# EAGLE design WH-MDC05F3E5_comm_v2.0 (EAGLE 6.6.0)
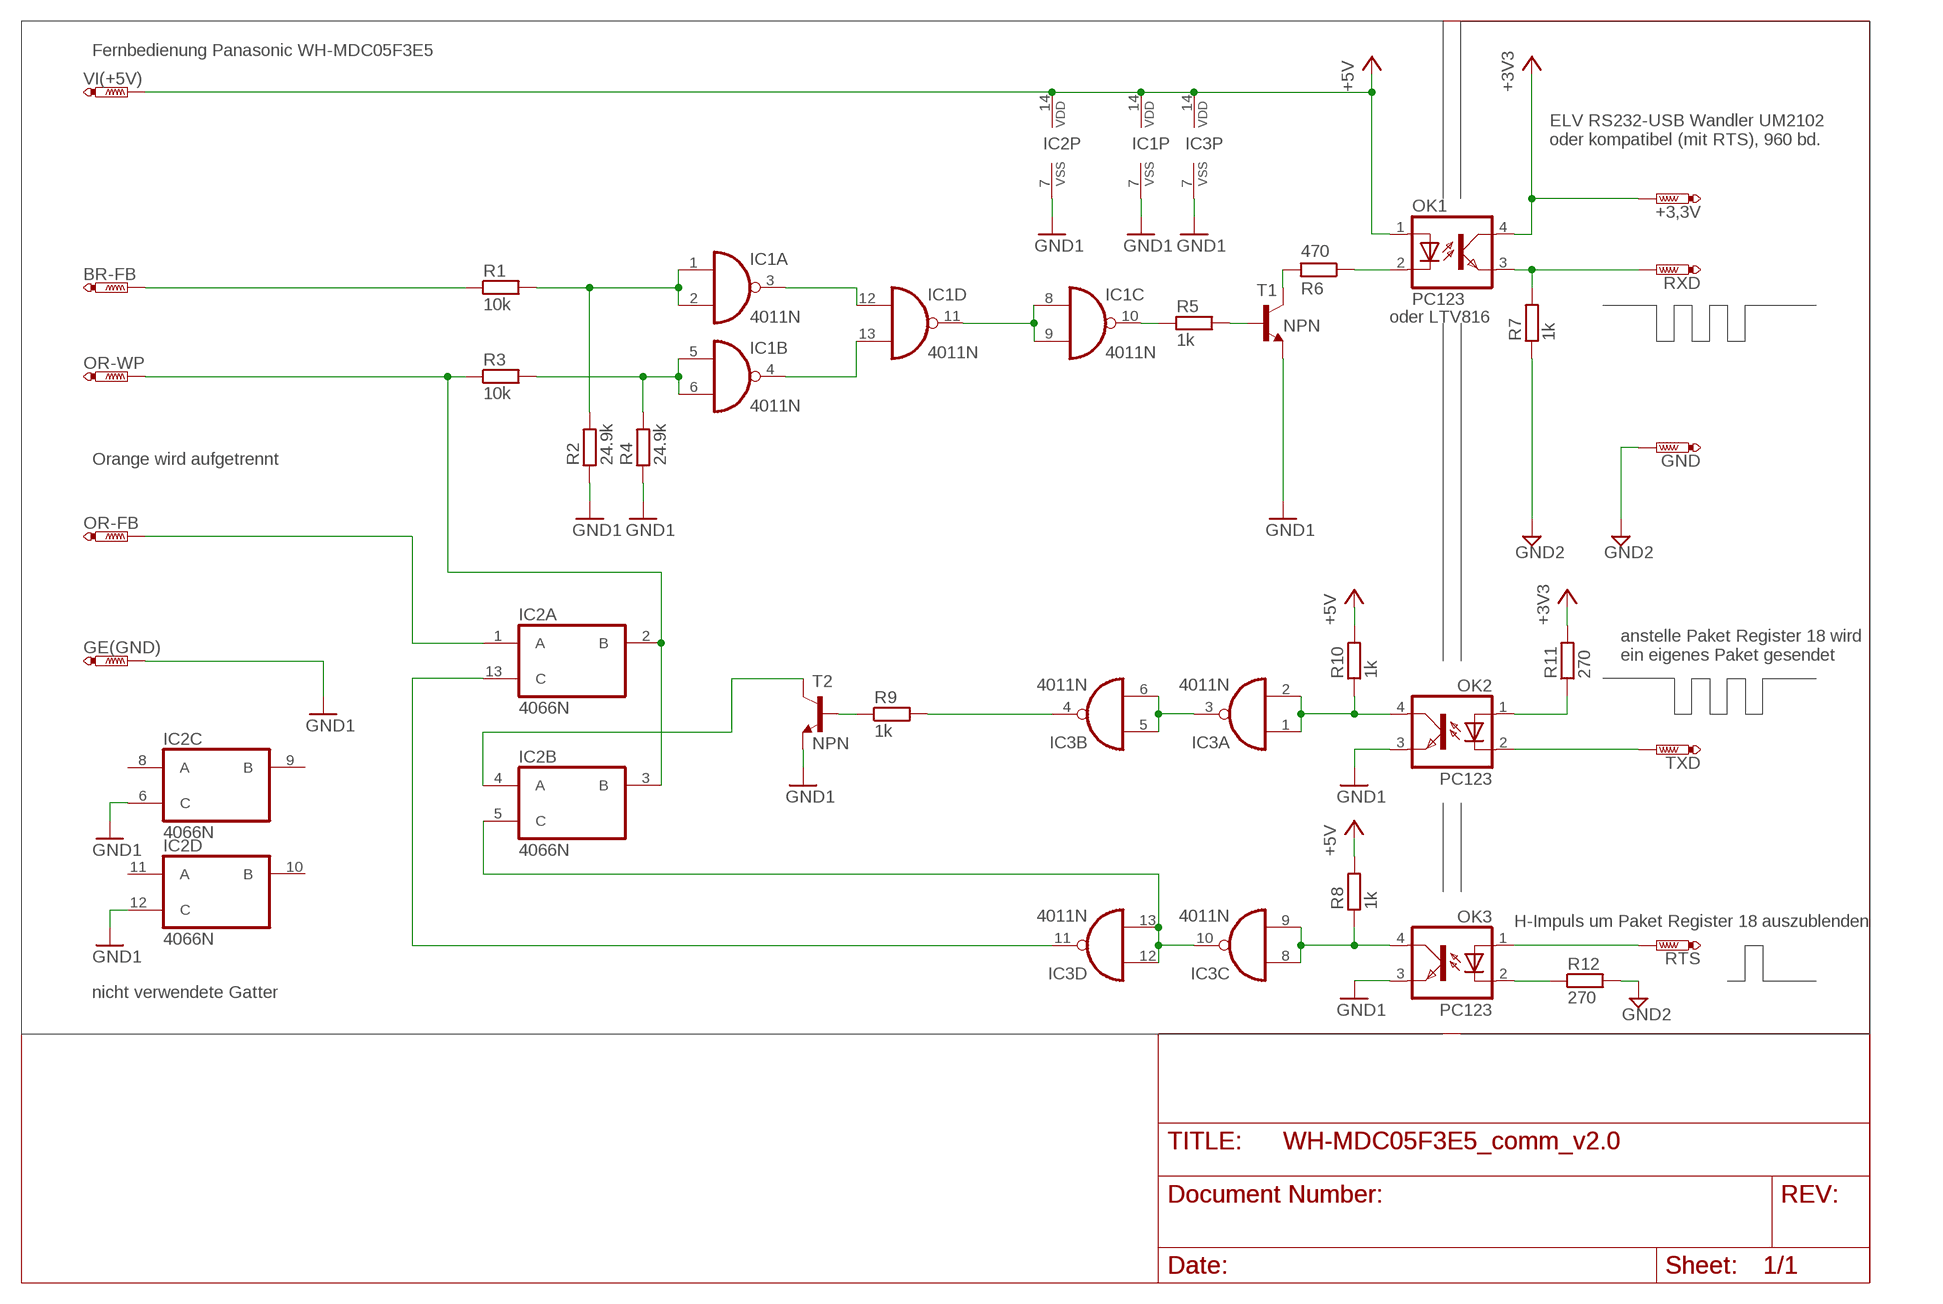
[diagram p0: schematic, sheet 1]

## Parts
+3,3V  PTR1PAD1-17  [P1-17]
BR-FB  PTR1PAD1-17  [P1-17]
GE(GND)  PTR1PAD1-17  [P1-17]
GND  PTR1PAD1-17  [P1-17]
IC1  4011N  [DIL14]
IC2  4066N  [DIL14]
IC3  4011N  [DIL14]
OK1  PC123  PC817  [DIL04]
OK2  PC123  PC817  [DIL04]
OK3  PC123  PC817  [DIL04]
OR-FB  PTR1PAD1-17  [P1-17]
OR-WP  PTR1PAD1-17  [P1-17]
R1  10k  R-EU_0207/10  [0207/10]
R2  24.9k  R-EU_0207/10  [0207/10]
R3  10k  R-EU_0207/10  [0207/10]
R4  24.9k  R-EU_0207/10  [0207/10]
R5  1k  R-EU_0207/10  [0207/10]
R6  470  R-EU_0207/10  [0207/10]
R7  1k  R-EU_0207/10  [0207/10]
R8  1k  R-EU_0207/7  [0207/7]
R9  1k  R-EU_0207/10  [0207/10]
R10  1k  R-EU_0207/7  [0207/7]
R11  270  R-EU_0207/7  [0207/7]
R12  270  R-EU_0207/7  [0207/7]
RTS  PTR1PAD1-17  [P1-17]
RXD  PTR1PAD1-17  [P1-17]
T1  NPN  BC547-NPN-TO92-CBE  [TO92-CBE]
T2  NPN  BC547-NPN-TO92-CBE  [TO92-CBE]
TXD  PTR1PAD1-17  [P1-17]
VI(+5V)  PTR1PAD1-17  [P1-17]

## Nets
+3V3: +3,3V.TP OK1.4(COL) R11.2
+5V: IC1.14(P:VDD) IC2.14(P:VDD) IC3.14(P:VDD) OK1.1(A) R8.2 R10.2 VI(+5V).TP
GND1: GE(GND).TP IC1.7(P:VSS) IC2.6(C:C) IC2.7(P:VSS) IC2.12(D:C) IC3.7(P:VSS) OK2.3(EMIT) OK3.3(EMIT) R2.1 R4.1 T1.E T2.E
GND2: GND.TP R7.1 R12.2
N$1: IC1.1(A:I0) IC1.2(A:I1) R1.2 R2.2
N$2: IC1.5(B:I0) IC1.6(B:I1) R3.2 R4.2
N$3: IC1.3(A:O) IC1.12(D:I0)
N$4: IC1.4(B:O) IC1.13(D:I1)
N$5: IC1.8(C:I0) IC1.9(C:I1) IC1.11(D:O)
N$6: IC1.10(C:O) R5.1
N$7: R5.2 T1.B
N$8: R6.2 T1.C
N$9: OK1.2(C) R6.1
N$10: OK1.3(EMIT) R7.2 RXD.TP
N$11: IC2.4(B:A) T2.C
N$12: OK2.1(A) R11.1
N$13: IC2.1(A:A) OR-FB.TP
N$14: IC2.2(A:B) IC2.3(B:B) OR-WP.TP R3.1
N$15: BR-FB.TP R1.1
N$16: OK2.2(C) TXD.TP
N$17: IC2.13(A:C) IC3.11(D:O)
N$18: IC3.8(C:I0) IC3.9(C:I1) OK3.4(COL) R8.1
N$19: IC2.5(B:C) IC3.10(C:O) IC3.12(D:I0) IC3.13(D:I1)
N$20: OK3.2(C) R12.1
N$21: OK3.1(A) RTS.TP
N$23: IC3.1(A:I0) IC3.2(A:I1) OK2.4(COL) R10.1
N$25: IC3.3(A:O) IC3.5(B:I0) IC3.6(B:I1)
N$26: R9.1 T2.B
N$27: IC3.4(B:O) R9.2
Unconnected: IC2.8(C:A) IC2.9(C:B) IC2.10(D:B) IC2.11(D:A)

## Notes on the sheet
- Fernbedienung Panasonic WH-MDC05F3E5
- ELV RS232-USB Wandler UM2102
  oder kompatibel (mit RTS), 960 bd.
- oder LTV816
- Orange wird aufgetrennt
- anstelle Paket Register 18 wird
  ein eigenes Paket gesendet
- H-Impuls um Paket Register 18 auszublenden
- nicht verwendete Gatter

## Library data of the parts
+3,3V BR-FB GE(GND) GND OR-FB OR-WP RTS RXD TXD VI(+5V) = testpad:PTR1: TEST PIN
IC1 IC3 = 40xx:4011: Quad 2-input NAND
IC2 = 40xx:4066: Quad bilateral ANALOG SWITCH
OK1-OK3 = optocoupler:PC817: SHARP OPTO COUPLER; MPN: PC817X4J000F; OC_FARNELL: 9707727; OC_NEWARK: 97K7059
R1-R12 = resistor:R-EU_: RESISTOR, European symbol
T1 T2 = transistor:*-NPN-: NPN Transistror BF959 corrected 2008.03.06

## Board
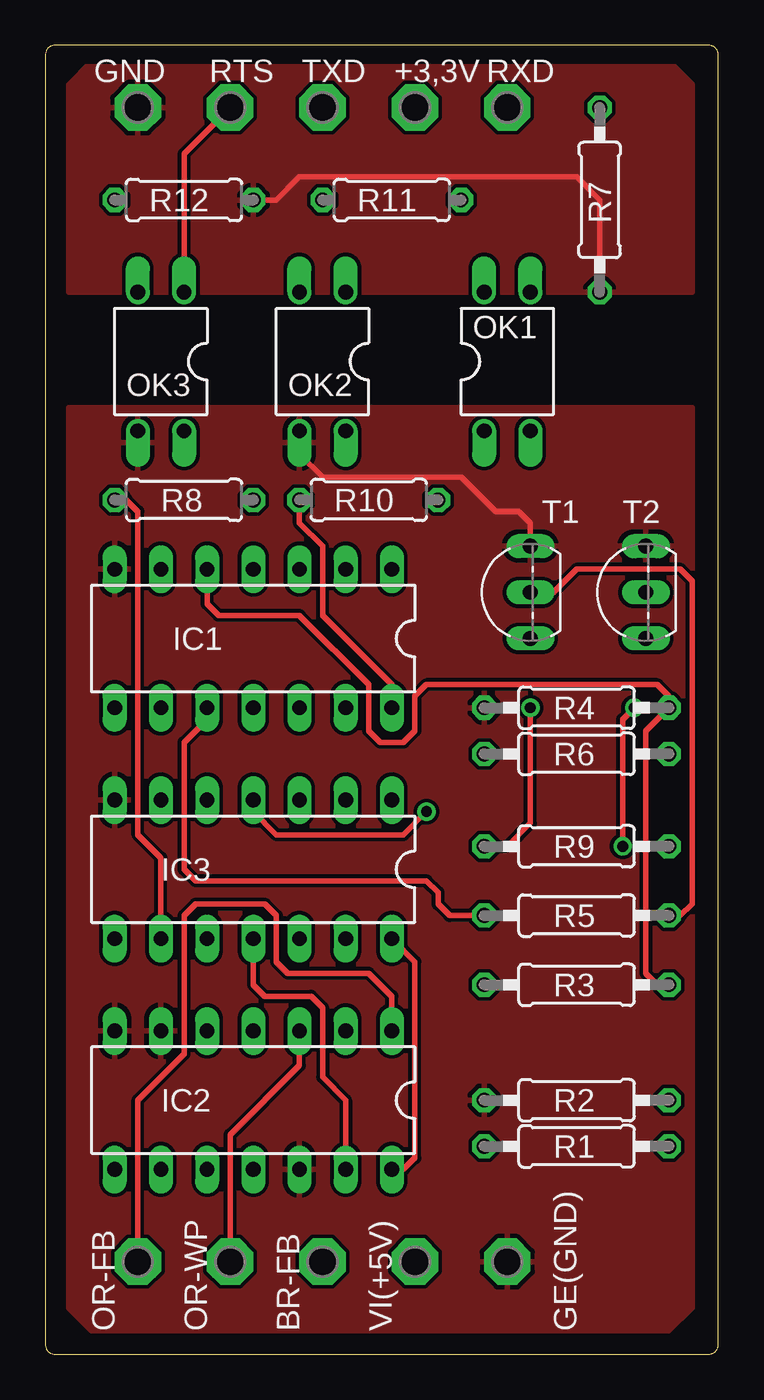
[diagram p1: board, top side]
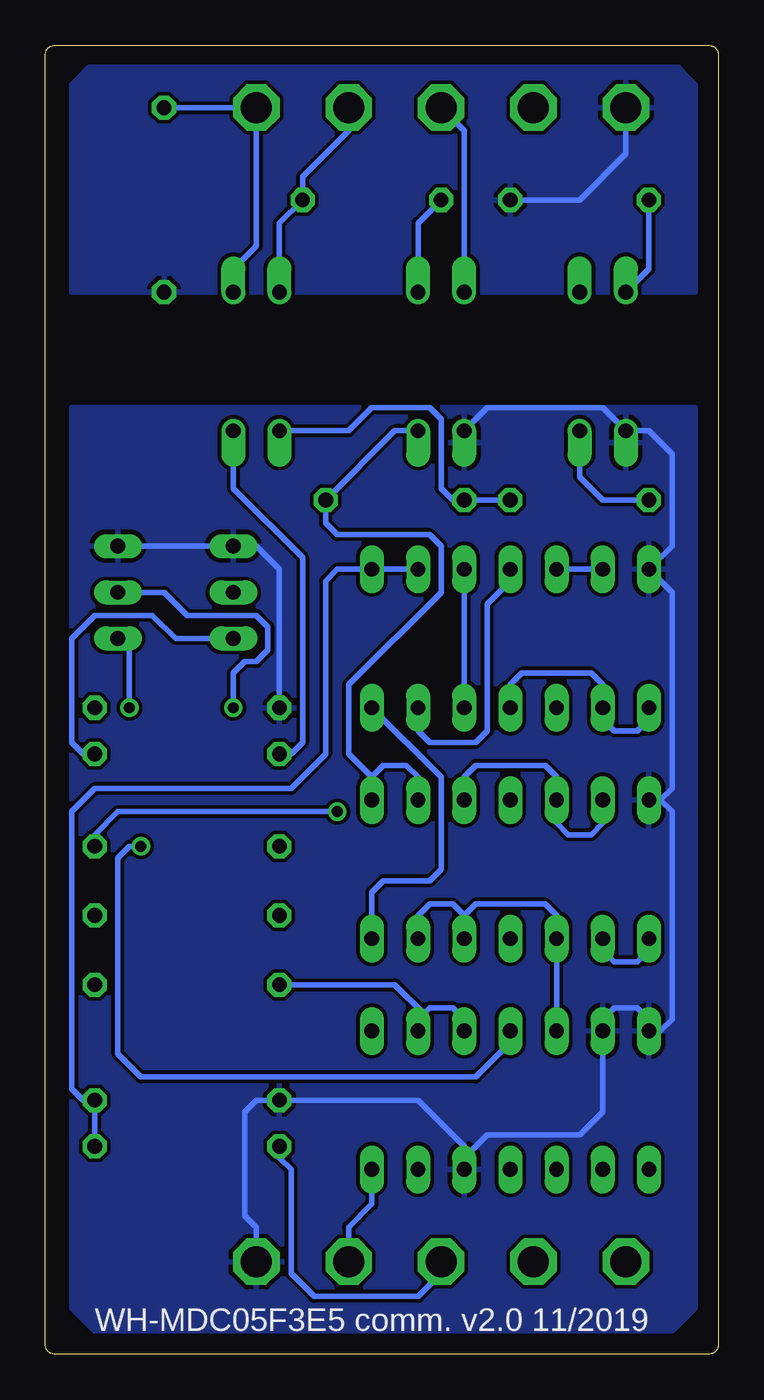
[diagram p2: board, bottom side, seen from below]

Size 37 x 72 mm. Coordinates in mm from the lower left corner, seen from the top.
Outline: 0,71.5 0,0.5 arc90 0.5,0 36.5,0 arc90 37,0.5 37,71.5 arc90 36.5,72 0.5,72 arc90 0,71.5
Copper layers (1*16): Top 0.035mm / dielectric 1.5mm / Bottom 0.035mm
Design rules "default": minimum track width 10mil, minimum drill 24mil, track to track 8mil, track to pad 8mil, pad to pad 8mil, via to via 8mil, smd to smd 8mil, copper to edge 40mil, drill to drill 8mil, minimum pad ring 10mil, minimum via ring 8mil, stop-mask expansion 4mil, vias tented up to drill 0mil, thermal gap 10mil

### Footprints (pad centres in the part's own frame; a part is rotated, then mirrored left to right if it is on the bottom)
P1-17 = drill 1.702 pad 2.54 octagon: TP 0,0
DIL14 = drill 0.813 long: 1 -7.62,-3.81; 2 -5.08,-3.81; 3 -2.54,-3.81; 4 0,-3.81; 5 2.54,-3.81; 6 5.08,-3.81; 7 7.62,-3.81; 8 7.62,3.81; 9 5.08,3.81; 10 2.54,3.81; 11 0,3.81; 12 -2.54,3.81; 13 -5.08,3.81; 14 -7.62,3.81
DIL04 = drill 0.813 offset: 1 -1.27,-3.81; 2 1.27,-3.81; 3 1.27,3.81; 4 -1.27,3.81
0207/10 = drill 0.813 octagon: 1 -5.08,0; 2 5.08,0
0207/7 = drill 0.813 octagon: 1 -3.81,0; 2 3.81,0
TO92-CBE = drill 0.813 long: B 0,0; C -2.54,0; E 2.54,0

### Placement (x,y rotation side)
+3,3V  20.32,68.58 0 top
BR-FB  15.24,5.08 0 top
GE(GND)  25.4,5.08 0 top
GND  5.08,68.58 0 top
IC1  11.43,39.37 180 top
IC2  11.43,13.97 180 top
IC3  11.43,26.67 180 top
OK1  25.4,54.61 0 top
OK2  15.24,54.61 180 top
OK3  6.35,54.61 180 top
OR-FB  5.08,5.08 0 top
OR-WP  10.16,5.08 0 top
R1  29.21,11.43 0 top
R2  29.21,13.97 0 top
R3  29.21,20.32 0 top
R4  29.21,35.56 0 top
R5  29.21,24.13 0 top
R6  29.21,33.02 0 top
R7  30.48,63.5 90 top
R8  7.62,46.99 0 top
R9  29.21,27.94 0 top
R10  17.78,46.99 180 top
R11  19.05,63.5 0 top
R12  7.62,63.5 0 top
RTS  10.16,68.58 0 top
RXD  25.4,68.58 0 top
T1  26.67,41.91 90 top
T2  33.02,41.91 90 top
TXD  15.24,68.58 0 top
VI(+5V)  20.32,5.08 0 top

### Tracks (layer width: path | path; a pad name or v marks a point on that pad's centre or on a via)
+3V3
  Bottom 0.305: OK1.4 24.13,62.23 R11.2 22.86,64.77 20.32,67.31 +3,3V.TP
+5V
  Top 0.305: IC1.14 19.05,36.83 15.24,40.64 15.24,44.45 13.97,45.72 R10.2 | IC2.14 19.68,10.16 20.32,10.79 20.32,21.59 IC3.14
  Bottom 0.305: R8.2 R10.2 14.61,46.99 15.24,47.62 15.24,51.44 15.88,52.07 19.05,52.07 20.32,50.8 OK1.1 | IC2.14 19.05,8.26 20.32,6.99 VI(+5V).TP | IC1.14 15.24,31.75 15.24,26.67 15.88,26.04 18.41,26.04 19.05,25.4 IC3.14
GND1
  Top 0.305: OK2.3 13.97,49.53 15.24,48.26 22.86,48.26 24.77,46.35 26.04,46.35 26.67,45.72 T1.E
  Bottom 0.305: OK2.3 12.7,52.07 6.35,52.07 OK3.3 3.81,50.8 2.54,49.53 2.54,44.45 IC1.7 2.54,41.91 2.54,31.11 3.17,30.48 | T2.E T1.E 25.4,44.45 24.13,43.18 R4.1 | 3.17,30.48 IC3.7 | 3.17,30.48 2.54,29.84 2.54,18.41 3.17,17.78 IC2.7 3.81,18.41 4.45,19.05 5.71,19.05 6.35,18.41 IC2.6 6.35,13.34 7.62,12.06 12.7,12.06 13.97,10.79 IC2.12 13.97,11.43 16.51,13.97 R2.1 25.4,13.97 26.04,13.34 26.04,7.62 25.4,6.99 GE(GND).TP
  pour Bottom: 1.27,2.54 2.54,1.27 34.29,1.27 35.56,2.54 35.56,52.07 1.27,52.07
  pour Top: 1.27,52.07 35.56,52.07 35.56,2.54 34.29,1.27 2.54,1.27 1.27,2.54
GND2
  Top 0.305: R12.2 12.7,63.5 13.97,64.77 29.21,64.77 30.48,63.5 R7.1
  Bottom 0.305: GND.TP 5.08,66.04 7.62,63.5 R12.2
  pour Top: 1.27,69.85 2.54,71.12 34.29,71.12 35.56,69.85 35.56,58.42 1.27,58.42
  pour Bottom: 1.27,58.42 1.27,69.85 2.54,71.12 34.29,71.12 35.56,69.85 35.56,58.42
N$1
  Bottom 0.305: IC1.2 IC1.1 20.95,43.18 21.59,42.55 21.59,33.02 23.5,31.11 34.29,31.11 35.56,29.84 35.56,14.61 34.92,13.97 R2.2 R1.2
N$2
  Top 0.305: IC1.5 8.89,41.27 9.53,40.64 13.97,40.64 17.78,36.83 17.78,34.29 18.41,33.66 19.68,33.66 20.32,34.29 20.32,36.2 20.95,36.83 33.66,36.83 34.29,36.2 R4.2 33.02,34.29 33.02,20.95 33.66,20.32 R3.2
  Bottom 0.305: IC1.6 IC1.5
N$3
  Bottom 0.305: IC1.12 IC1.3
N$4
  Bottom 0.305: IC1.13 16.51,34.29 15.88,33.66 13.34,33.66 12.7,34.29 12.7,41.27 11.43,42.55 IC1.4
N$5
  Bottom 0.305: IC1.8 3.81,34.92 4.45,34.29 5.71,34.29 6.35,34.92 IC1.9 6.35,36.83 6.99,37.47 10.79,37.47 11.43,36.83 IC1.11
N$6
  Top 0.305: R5.1 22.23,24.13 21.59,24.77 21.59,25.4 20.95,26.04 8.26,26.04 7.62,26.67 7.62,33.66 8.89,34.92 IC1.10
N$7
  Top 0.305: R5.2 34.92,24.13 35.56,24.77 35.56,42.55 34.92,43.18 29.21,43.18 27.94,41.91 T1.B
N$8
  Bottom 0.305: T1.C 29.84,39.37 31.11,40.64 34.29,40.64 35.56,39.37 35.56,33.66 34.92,33.02 R6.2
N$9
  Bottom 0.305: OK1.2 26.67,47.62 22.86,43.81 22.86,33.66 23.5,33.02 R6.1
N$10
  Bottom 0.305: R7.2 RXD.TP 25.4,60.96 26.67,59.69 OK1.3
N$11  (via drill 0.6)
  Top 0.305: v31.75,27.94 31.75,34.92 v32.38,35.56
  Bottom 0.305: IC2.4 11.43,17.14 13.34,15.24 31.75,15.24 33.02,16.51 33.02,27.3 32.38,27.94 v31.75,27.94 | v32.38,35.56 32.38,38.73 T2.C
N$12
  Bottom 0.305: OK2.1 16.51,62.23 R11.1
N$13
  Top 0.305: IC2.1 19.05,19.68 17.78,20.95 13.34,20.95 12.7,21.59 12.7,24.13 12.06,24.77 8.26,24.77 7.62,24.13 7.62,16.51 5.08,13.97 OR-FB.TP
N$14
  Top 0.305: OR-WP.TP 10.16,12.06 13.97,15.88 IC2.3
  Bottom 0.305: IC2.3 13.97,18.41 14.61,19.05 15.88,19.05 16.19,18.73 | 16.19,18.73 16.51,18.41 IC2.2 | R3.1 17.78,20.32 16.19,18.73
N$15
  Bottom 0.305: BR-FB.TP 15.24,4.45 16.51,3.17 22.23,3.17 23.5,4.45 23.5,10.16 24.13,10.79 R1.1
N$16
  Bottom 0.305: OK2.2 13.97,67.31 TXD.TP
N$17
  Top 0.305: IC3.11 11.43,20.32 12.06,19.68 14.61,19.68 15.24,19.05 15.24,15.24 16.51,13.97 IC2.13
N$18
  Top 0.305: IC3.9 6.35,27.3 5.08,28.57 5.08,46.35 4.45,46.99 R8.1
  Bottom 0.305: R8.1 6.35,46.99 7.62,48.26 OK3.4 | IC3.8 3.81,22.23 4.45,21.59 5.71,21.59 6.35,22.23 IC3.9
N$19
  Bottom 0.305: IC2.5 IC3.10 8.89,24.13 9.53,24.77 13.34,24.77 13.97,24.13 | 13.97,24.13 IC3.12 | IC3.13 16.51,24.13 15.88,24.77 14.61,24.77 13.97,24.13
N$20
  Bottom 0.305: R12.1 3.81,59.69 OK3.2
N$21
  Top 0.305: OK3.1 7.62,66.04 RTS.TP
N$23
  Bottom 0.305: OK2.4 17.78,50.8 R10.1 21.59,45.72 20.95,45.09 15.88,45.09 15.24,44.45 15.24,41.91 20.32,36.83 20.32,33.02 19.05,31.75 | IC3.2 16.51,31.75 17.14,32.38 18.41,32.38 19.05,31.75 | IC3.1 19.05,31.75
N$25
  Bottom 0.305: IC3.3 13.97,31.75 13.34,32.38 9.53,32.38 8.89,31.75 IC3.5 8.89,29.21 8.26,28.57 6.99,28.57 6.35,29.21 IC3.6
N$26  (via drill 0.6)
  Top 0.305: R9.1 25.4,27.94 26.67,29.21 v26.67,35.56
  Bottom 0.305: T2.B 30.48,41.91 29.21,40.64 25.4,40.64 24.77,40.01 24.77,38.73 25.4,38.1 26.04,38.1 26.67,37.47 v26.67,35.56
N$27  (via drill 0.6)
  Top 0.305: v20.95,29.84 19.68,28.57 12.7,28.57 11.43,29.84 IC3.4
  Bottom 0.305: R9.2 34.29,28.57 33.02,29.84 v20.95,29.84

### Text on the board
bPlace: WH-MDC05F3E5 comm. v2.0 11/2019